# EAGLE design onion_dip_v21 (EAGLE 6.5.0)
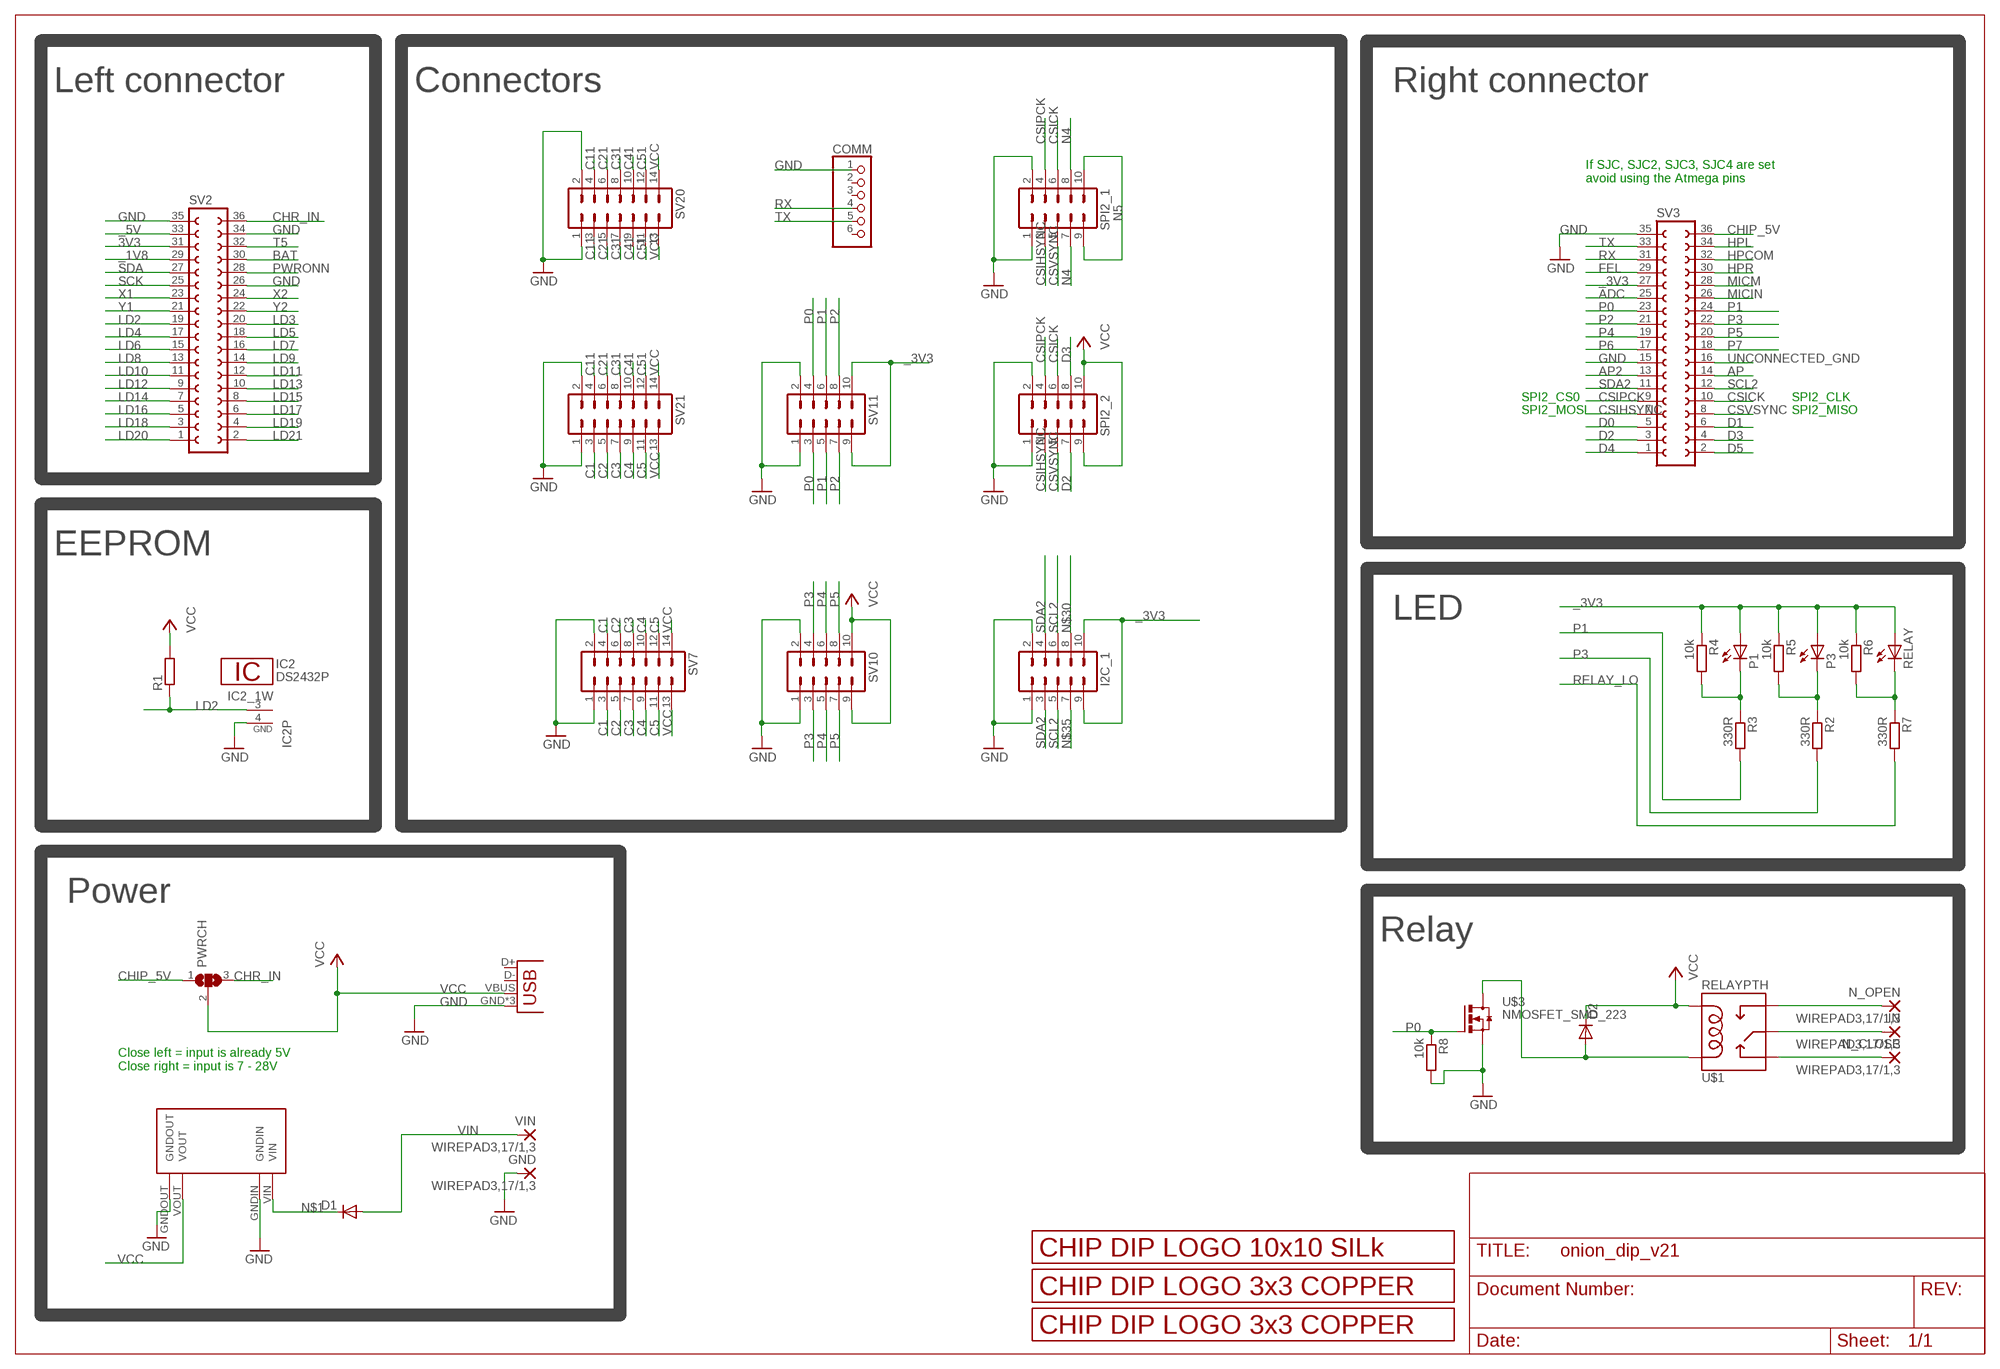
[diagram p0: schematic, sheet 1]

## Parts
COMM  PINHD-1X6  [1X06]
D1  DIODE-SMB  [SMB]
D2  DIODE-SMB  [SMB]
GND  WIREPAD3,17/1,3  [3,17/1,3]
I2C_1  MA05-2  [MA05-2]
IC2  DS2432P  [TSOC6]
IN  WIREPAD3,17/1,3  [3,17/1,3]
N_CLOSE  WIREPAD3,17/1,3  [3,17/1,3]
N_OPEN  WIREPAD3,17/1,3  [3,17/1,3]
P1  LEDCHIP-LED0805  [CHIP-LED0805]
P3  LEDCHIP-LED0805  [CHIP-LED0805]
PWRCH  SJ2W  [SJ_2]
R1  R-EU_R0805  [R0805]
R2  330R  R-EU_R0805  [R0805]
R3  330R  R-EU_R0805  [R0805]
R4  10k  R-EU_R0805  [R0805]
R5  10k  R-EU_R0805  [R0805]
R6  10k  R-EU_R0805  [R0805]
R7  330R  R-EU_R0805  [R0805]
R8  10k  R-EU_R0805  [R0805]
RELAY  LEDCHIP-LED0805  [CHIP-LED0805]
SPI2_1  MA05-2  [MA05-2]
SPI2_2  MA05-2  [MA05-2]
SV2  FE18-2  [FE18-2]
SV3  FE18-2  [FE18-2]
SV7  MA07-2  [MA07-2]
SV10  MA05-2  [MA05-2]
SV11  MA05-2  [MA05-2]
SV20  MA07-2  [MA07-2]
SV21  MA07-2  [MA07-2]
U$1  RELAYPTH  [SRD-05VDC-SL-C]
U$3  NMOSFET_SMD_223  [SOT223]
U$4  LOGO_3X3_COPPER  [LOGO_3X3_COPPER]
U$5  LOGO_10X10_SILK  [LOGO_10X10_SILK]
U$6  LOGO_3X3_COPPER  [LOGO_3X3_COPPER]
U$9  MP1584EN_FRAMELESS  [MP1584EN_FRAMELESS]
USB  USBUSB-MICROB-SMT-DIP  [USB-MICROB-SMT-DIP]
VIN  WIREPAD3,17/1,3  [3,17/1,3]

## Nets
3V3: SV2.31
_1V8: SV2.29
_3V3: I2C_1.9 I2C_1.10 P1.A P3.A R4.1 R5.1 R6.1 RELAY.A SV3.27 SV11.9 SV11.10
_5V: SV2.33
ADC: SV3.25
AP: SV3.14
AP2: SV3.13
BAT: SV2.30
C1: SV7.3 SV7.4 SV21.3
C2: SV7.5 SV7.6 SV21.5
C3: SV7.7 SV7.8 SV21.7
C4: SV7.9 SV7.10 SV21.9
C5: SV7.11 SV7.12 SV21.11
C11: SV20.3 SV20.4 SV21.4
C21: SV20.5 SV20.6 SV21.6
C31: SV20.7 SV20.8 SV21.8
C41: SV20.9 SV20.10 SV21.10
C51: SV20.11 SV20.12 SV21.12
CHIP_5V: PWRCH.1 SV3.36
CHR_IN: PWRCH.3 SV2.36
CSICK: SPI2_1.6 SPI2_2.6 SV3.10
CSIHSYNC: SPI2_1.3 SPI2_2.3 SV3.7
CSIPCK: SPI2_1.4 SPI2_2.4 SV3.9
CSVSYNC: SPI2_1.5 SPI2_2.5 SV3.8
D0: SV3.5
D1: SV3.6
D2: SPI2_2.7 SV3.3
D3: SPI2_2.8 SV3.4
D4: SV3.1
D5: SV3.2
FEL: SV3.29
GND: COMM.1 GND.1(P) I2C_1.1 I2C_1.2 IC2.4(GND) R8.2 SPI2_1.1 SPI2_1.2 SPI2_2.1 SPI2_2.2 SV2.26 SV2.34 SV2.35 SV3.15 SV3.35 SV7.1 SV7.2 SV10.1 SV10.2 SV11.1 SV11.2 SV20.1 SV20.2 SV21.1 SV21.2 U$3.3(S) U$9.GNDIN U$9.GNDOUT USB.GND USB.MT1(GND) USB.MT2(GND)
HPCOM: SV3.32
HPL: SV3.34
HPR: SV3.30
LD2: IC2.3(1W) R1.1 SV2.19
LD3: SV2.20
LD4: SV2.17
LD5: SV2.18
LD6: SV2.15
LD7: SV2.16
LD8: SV2.13
LD9: SV2.14
LD10: SV2.11
LD11: SV2.12
LD12: SV2.9
LD13: SV2.10
LD14: SV2.7
LD15: SV2.8
LD16: SV2.5
LD17: SV2.6
LD18: SV2.3
LD19: SV2.4
LD20: SV2.1
LD21: SV2.2
MICIN: SV3.26
MICM: SV3.28
N4: SPI2_1.7 SPI2_1.8
N5: SPI2_1.9 SPI2_1.10
N$1: D1.C U$9.VIN
N$3: P3.C R2.1 R5.2
N$4: P1.C R3.1 R4.2
N$29: R6.2 R7.1 RELAY.C
N$30: I2C_1.8
N$35: I2C_1.7
NCL: N_CLOSE.1(P) U$1.SWCLOSED(SWCLOSE)
NOP: N_OPEN.1(P) U$1.SWOPEN
P0: R8.1 SV3.23 SV11.3 SV11.4 U$3.1(G)
P1: R3.2 SV3.24 SV11.5 SV11.6
P2: SV3.21 SV11.7 SV11.8
P3: R2.2 SV3.22 SV10.3 SV10.4
P4: SV3.19 SV10.5 SV10.6
P5: SV3.20 SV10.7 SV10.8
P6: SV3.17
P7: SV3.18
PWRONN: SV2.28
RELAY_LO: D2.A R7.2 U$1.COIL1 U$3.2(D) U$3.4(D)
RIN: IN.1(P) U$1.SWCOMMON
RX: COMM.4 SV3.31
SCK: SV2.25
SCL2: I2C_1.5 I2C_1.6 SV3.12
SDA: SV2.27
SDA2: I2C_1.3 I2C_1.4 SV3.11
T5: SV2.32
TX: COMM.5 SV3.33
UNCONNECTED_GND: SV3.16
VCC: D2.C PWRCH.2 R1.2 SPI2_2.9 SPI2_2.10 SV7.13 SV7.14 SV10.9 SV10.10 SV20.13 SV20.14 SV21.13 SV21.14 U$1.COIL0 U$9.VOUT USB.VBUS
VIN: D1.A VIN.1(P)
X1: SV2.23
X2: SV2.24
Y1: SV2.21
Y2: SV2.22
Unconnected: COMM.2 COMM.3 COMM.6 USB.D+ USB.D-

## Notes on the sheet
- Left connector | Connectors | Right connector
- If SJC, SJC2, SJC3, SJC4 are set 
  avoid using the Atmega pins
- SPI2_CS0 | SPI2_CLK
- SPI2_MOSI | SPI2_MISO
- EEPROM
- LED
- Power
- Relay
- Close left = input is already 5V
  Close right = input is 7 - 28V

## Library data of the parts
COMM = pinhead:PINHD-1X6: PIN HEADER
D1 D2 = diode:DIODE-: DIODE
GND IN N_CLOSE N_OPEN VIN = wirepad:WIREPAD: Wire PAD connect wire on PCB
I2C_1 SPI2_1 SPI2_2 SV10 SV11 = con-lstb_no_frame:MA05-2: PIN HEADER; OC_FARNELL: unknown; OC_NEWARK: unknown
IC2 = 1wire:DS2432: 1024-Bit Protected EEPROM with SHA-1 Engine This chip is a cryptographic device, providing 1024 Bits of EEPROM memory which may be written only after supplying the correct 64 bit secret. the secret cannot be read back from the device. The other features of this chip are like the DS2431. Please note the SHA-1 hash algorithm is considered weak if the data is not properly "padded". If you don't understand anything of this, don't use this chip. Author: Jan Kandziora <jjj@gmx.de>
P1 P3 RELAY = led:LED: LED OSRAM: - CHIPLED LG R971, LG N971, LY N971, LG Q971, LY Q971, LO R971, LY R971 LH N974, LH R974 LS Q976, LO Q976, LY Q976 LO Q996 - Hyper CHIPLED LW Q18S LB Q993, LB Q99A, LB R99A - SideLED LS A670, LO A670, LY A670, LG A670, LP A670 LB A673, LV A673, LT A673, LW A673 LH A674 LY A675 LS A676, LA A676, LO A676, LY A676, LW A676 LS A679, LY A679, LG A679 - Hyper Micro SIDELED® LS Y876, LA Y876, LO Y876, LY Y876 LT Y87S - SmartLED LW L88C, LW L88S LB L89C, LB L89S, LG L890 LS L89K, LO L89K, LY L89K LS L896, LA L896, LO L896, LY L896 - TOPLED LS T670, LO T670, LY T670, LG T670, LP T670 LSG T670, LSP T670, LSY T670, LOP T670, LYG T670 LG T671, LOG T671, LSG T671 LB T673, LV T673, LT T673, LW T673 LH T674 LS T676, LA T676, LO T676, LY T676, LB T676, LH T676, LSB T676, LW T676 LB T67C, LV T67C, LT T67C, LS T67K, LO T67K, LY T67K, LW E67C LS E67B, LA E67B, LO E67B, LY E67B, LB E67C, LV E67C, LT E67C LW T67C LS T679, LY T679, LG T679 LS T770, LO T770, LY T770, LG T770, LP T770 LB T773, LV T773, LT T773, LW T773 LH T774 LS E675, LA E675, LY E675, LS T675 LS T776, LA T776, LO T776, LY T776, LB T776 LHGB T686 LT T68C, LB T68C - Hyper Mini TOPLED® LB M676 - Mini TOPLED Santana® LG M470 LS M47K, LO M47K, LY M47K Source: http://www.osram.convergy.de LUXEON: - LUMILED® LXK2-PW12-R00, LXK2-PW12-S00, LXK2-PW14-U00, LXK2-PW14-V00 LXK2-PM12-R00, LXK2-PM12-S00, LXK2-PM14-U00 LXK2-PE12-Q00, LXK2-PE12-R00, LXK2-PE12-S00, LXK2-PE14-T00, LXK2-PE14-U00 LXK2-PB12-K00, LXK2-PB12-L00, LXK2-PB12-M00, LXK2-PB14-N00, LXK2-PB14-P00, LXK2-PB14-Q00 LXK2-PR12-L00, LXK2-PR12-M00, LXK2-PR14-Q00, LXK2-PR14-R00 LXK2-PD12-Q00, LXK2-PD12-R00, LXK2-PD12-S00 LXK2-PH12-R00, LXK2-PH12-S00 LXK2-PL12-P00, LXK2-PL12-Q00, LXK2-PL12-R00 Source: www.luxeon.com KINGBRIGHT: KA-3528ASYC Source: www.kingbright.com
PWRCH = jumper:SJ2W: SMD solder JUMPER
R1-R8 = rcl:R-EU_: RESISTOR, European symbol
SV2 SV3 = con-lsta:FE18-2: FEMALE HEADER; OC_FARNELL: unknown; OC_NEWARK: unknown
SV7 SV20 SV21 = con-lstb_no_frame:MA07-2: PIN HEADER; OC_FARNELL: unknown; OC_NEWARK: unknown
U$1 = SRD-05VDC-SL-C:RELAY: SPDT relay (COM-00101)
U$3 = transistor-power:NMOSFET_SMD_223
U$4 U$6 = logo:LOGO_3X3_COPPER
U$5 = logo:LOGO_10X10_SILK
U$9 = power_supply:MP1584EN_FRAMELESS
USB = Spark:USB

## Board
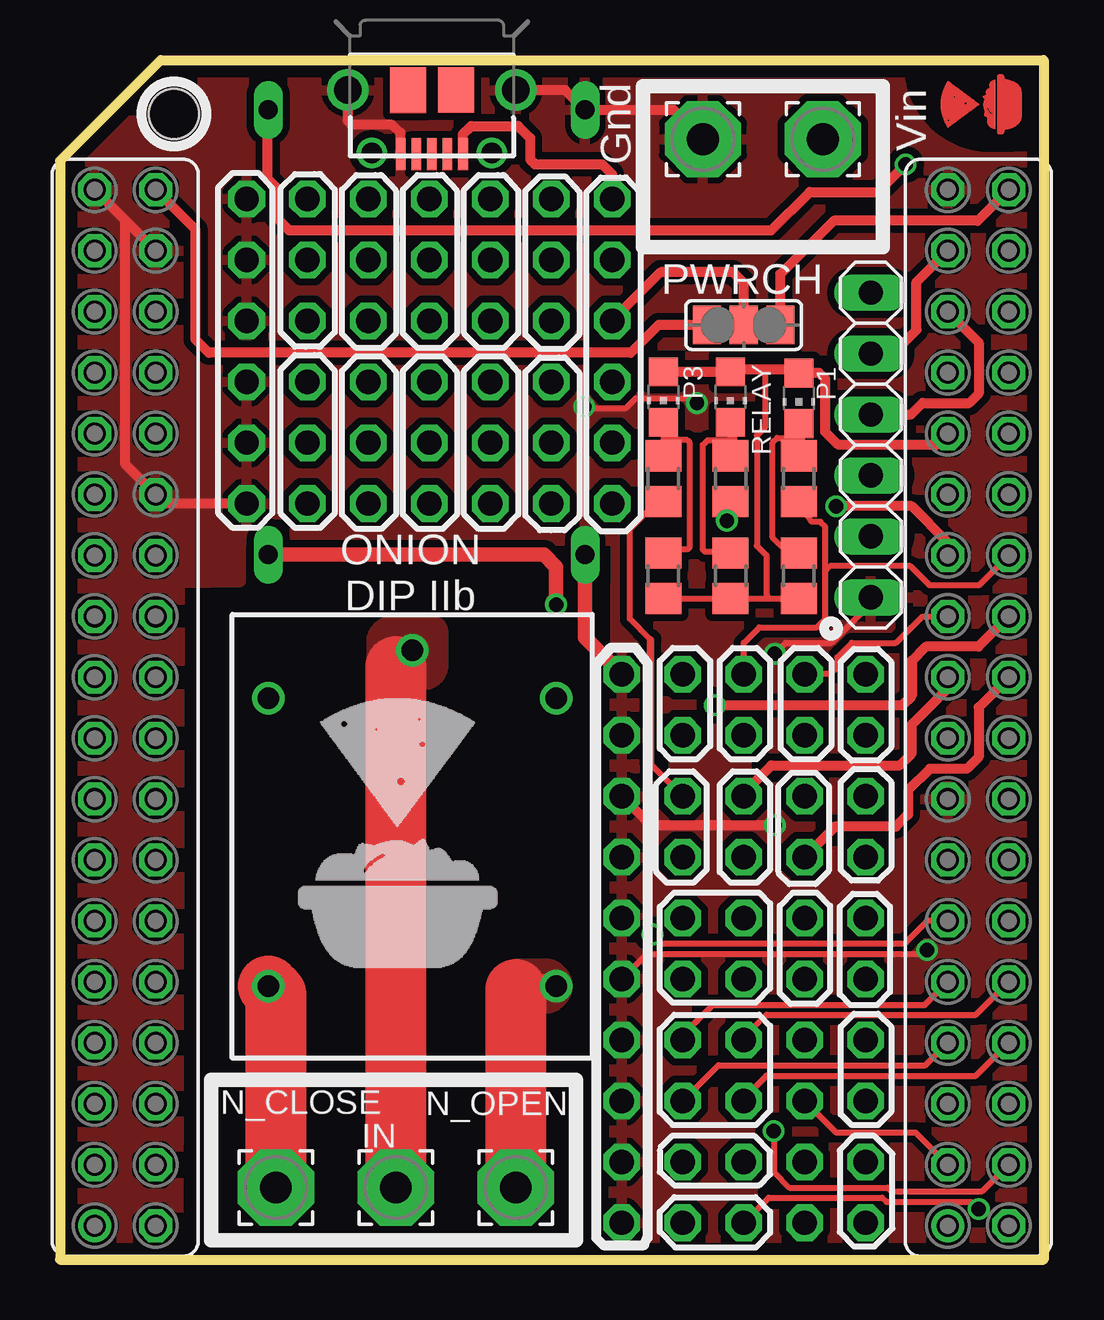
[diagram p1: board, top side]
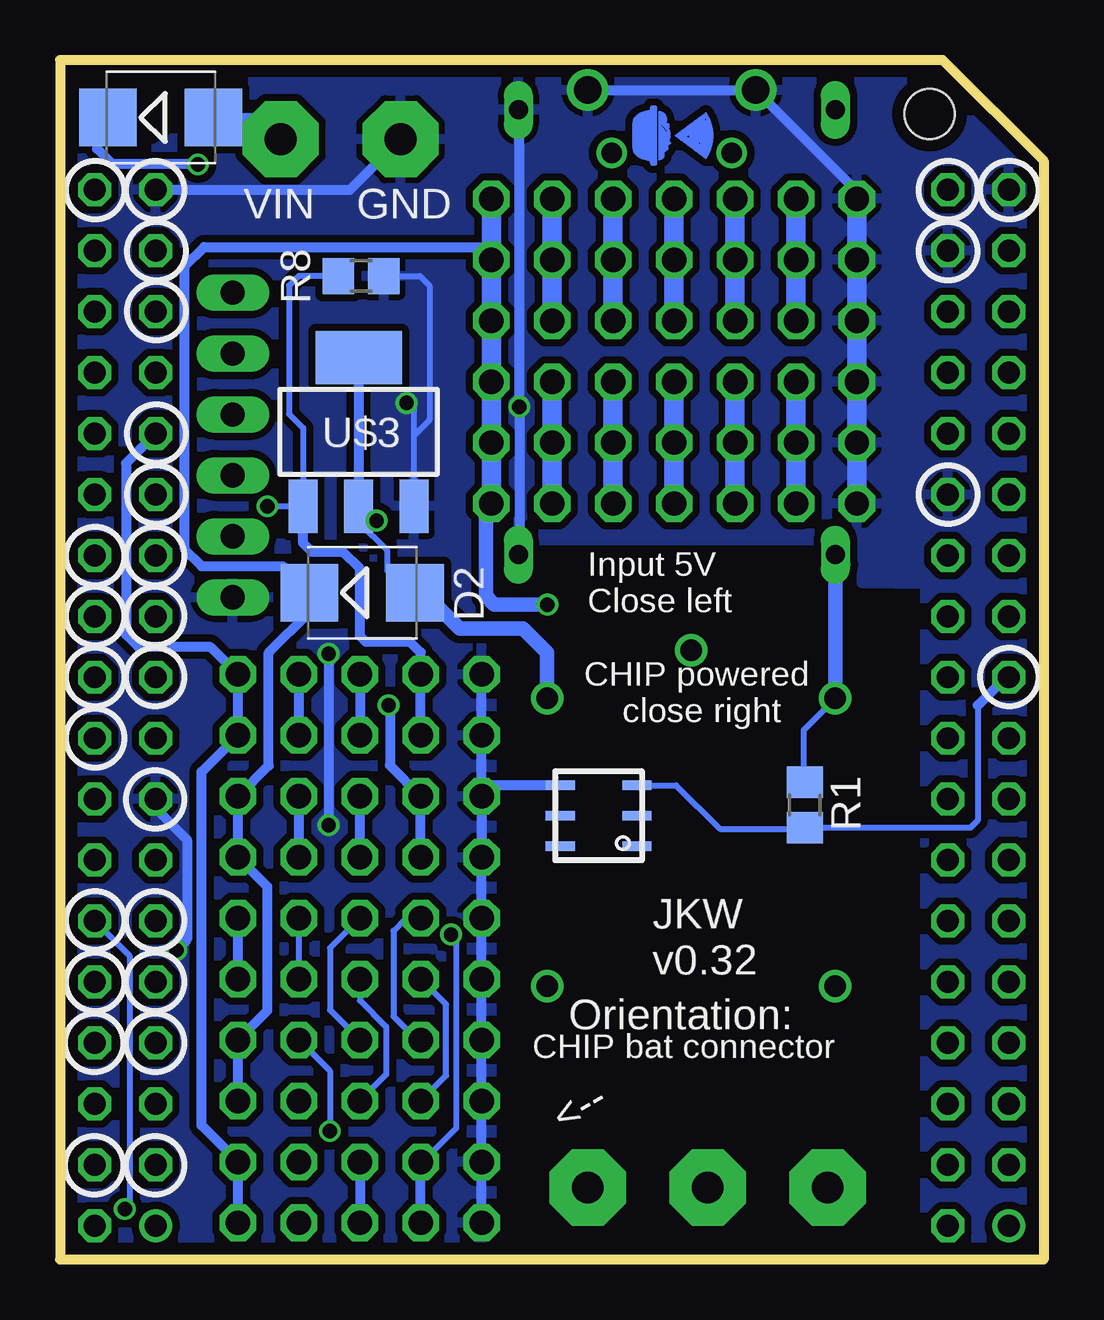
[diagram p2: board, bottom side, seen from below]

Size 41 x 50 mm. Coordinates in mm from the lower left corner, seen from the top.
Outline: 4.2,50 41,50 41,0 0,0 0,45.8 4.2,50
Copper layers (1*16): Top 0.035mm / dielectric 1.6mm / Bottom 0.035mm
Design rules "Elecrow_2-layer_PCB_eagle_rule": minimum track width 6mil, minimum drill 12mil, track to track 6mil, track to pad 6mil, pad to pad 6mil, via to via 8mil, smd to smd 0mil, copper to edge 20mil, drill to drill 10mil, minimum pad ring 6mil, minimum via ring 6mil, stop-mask expansion 0mil, vias tented up to drill 100mil, thermal gap 10mil
Holes 2.1 mm at 4.75,47.75

### Footprints (pad centres in the part's own frame; a part is rotated, then mirrored left to right if it is on the bottom)
1X06 = drill 1.016 long: 1 -6.35,0; 2 -3.81,0; 3 -1.27,0; 4 1.27,0; 5 3.81,0; 6 6.35,0
SMB = smd 2.4 x 2.4: A 2.2,0; C -2.2,0
3,17/1,3 = drill 1.321 pad 3.175 octagon: 1 0,0
MA05-2 = drill 1.016 octagon: 1 -5.08,-1.27; 2 -5.08,1.27; 3 -2.54,-1.27; 4 -2.54,1.27; 5 0,-1.27; 6 0,1.27; 7 2.54,-1.27; 8 2.54,1.27; 9 5.08,-1.27; 10 5.08,1.27
TSOC6 = smd 0.406 x 1.219: 1 -1.27,-1.6; 2 0,-1.6; 3 1.27,-1.6; 4 1.27,1.6; 5 0,1.6; 6 -1.27,1.6
CHIP-LED0805 = smd 1.2 x 1.2: A 0,-1.05; C 0,1.05
SJ_2 = smd 1.168 x 1.6: 1 -1.524,0; 2 0,0; 3 1.524,0
R0805 = smd 1.3 x 1.5: 1 -0.95,0; 2 0.95,0
FE18-2 = drill 0.914: 1 -21.59,1.27 | drill 0.914 octagon: 2 -21.59,-1.27; 3 -19.05,1.27; 4 -19.05,-1.27; 5 -16.51,1.27; 6 -16.51,-1.27; 7 -13.97,1.27; 8 -13.97,-1.27; 9 -11.43,1.27; 10 -11.43,-1.27; 11 -8.89,1.27; 12 -8.89,-1.27; 13 -6.35,1.27; 14 -6.35,-1.27; 15 -3.81,1.27; 16 -3.81,-1.27; 17 -1.27,1.27; 18 -1.27,-1.27; 19 1.27,1.27; 20 1.27,-1.27; 21 3.81,1.27; 22 3.81,-1.27; 23 6.35,1.27; 24 6.35,-1.27; 25 8.89,1.27; 26 8.89,-1.27; 27 11.43,1.27; 28 11.43,-1.27; 29 13.97,1.27; 30 13.97,-1.27; 31 16.51,1.27; 32 16.51,-1.27; 33 19.05,1.27; 34 19.05,-1.27; 35 21.59,1.27; 36 21.59,-1.27
MA07-2 = drill 1.016 octagon: 1 -7.62,-1.27; 2 -7.62,1.27; 3 -5.08,-1.27; 4 -5.08,1.27; 5 -2.54,-1.27; 6 -2.54,1.27; 7 0,-1.27; 8 0,1.27; 9 2.54,-1.27; 10 2.54,1.27; 11 5.08,-1.27; 12 5.08,1.27; 13 7.62,-1.27; 14 7.62,1.27
SRD-05VDC-SL-C = drill 0.9: COIL0 -5.39,-6.12; COIL1 -5.39,5.88; SWCLOSED 6.61,-6.12; SWCOMMON -7.39,-0.12; SWOPEN 6.61,5.88
SOT223 = smd 1.219 x 2.235: 1 -2.311,-3.099; 2 0,-3.099; 3 2.311,-3.099 | smd 3.6 x 2.2: 4 0,3.099
MP1584EN_FRAMELESS = drill 0.8 long: GNDIN 1.778,14.986; GNDOUT 20.32,14.986; VIN 1.778,1.778; VOUT 20.32,1.778
USB-MICROB-SMT-DIP = smd 0.4 x 1.35: D+ 0,2.675; D- -0.65,2.675; GND 1.3,2.675; ID 0.65,2.675; VBUS -1.3,2.675 | drill 1.15 pad 1.7: MT1 -3.5,0; MT2 3.5,0 | drill 0.85 pad 1.25: MT3 -2.5,2.625; MT4 2.5,2.625 | smd 1.5 x 1.9: P$1 -1,0; P$2 1,0.01

### Placement (x,y rotation side)
COMM  33.8,33.95 90 top
D1  36.8,47.6 0 bottom
D2  28.4,27.8 0 bottom
GND  26.8,46.7 180 top
I2C_1  28.5,2.8 0 top
IC2  18.55,18.5 90 bottom
IN  14,3 0 top
N_CLOSE  9,3 0 top
N_OPEN  19,3 0 top
P1  30.8,35.9 180 top
P3  25.15,35.95 180 top
PWRCH  28.5,38.95 180 top
R1  9.95,18.95 90 bottom
R2  25.15,32.55 270 top
R3  30.8,32.55 270 top
R4  30.8,28.5 90 top
R5  25.15,28.5 90 top
R6  27.95,28.5 90 top
R7  27.95,32.55 270 top
R8  28.45,41 0 bottom
RELAY  27.95,35.95 180 top
SPI2_1  28.5,12.96 0 top
SPI2_2  28.5,7.88 0 top
SV2  2.72,23 90 top
SV3  38.28,23 90 top
SV7  15.4,32.78 0 top
SV10  28.5,18.04 0 top
SV11  28.5,23.12 0 top
SV20  15.4,42.94 0 top
SV21  15.4,37.86 0 top
U$1  14.8,18 270 top
U$3  28.55,34.5 0 bottom
U$4  38.4,48.15 90 top
U$5  9.9,12.15 0 top
U$6  15.45,46.85 270 bottom
U$9  6.9,49.7 270 top
USB  15.5,48.75 180 top
VIN  31.8,46.7 180 top

### Tracks (layer width: path | path; a pad name or v marks a point on that pad's centre or on a via)
_3V3
  Top 0.254: 29.35,37.1 29.4,37.05 29.4,34.7 29.05,34.35 29.05,29.75 29.45,29.35 29.45,27.7 29.5,27.65 29.5,27.6 29.45,27.55 | R5.1 R6.1 29.45,27.55 | 29.45,27.55 R4.1
  Top 0.406: SV3.27 36.53,33.95 32.45,33.95 31.9,34.5 31.9,36.7 31.65,36.95 P1.A | 28.1,37 RELAY.A | P1.A 30.45,37.1 29.35,37.1 28.05,37.1 RELAY.A | 30.55,36.95 P1.A | RELAY.A P3.A
  Bottom 0.406: I2C_1.9 I2C_1.10 35.1,5.59 35.1,20.33 SV11.9 SV11.10 34.74,25.55 37.75,25.55 38.25,26.05 38.25,33.19 SV3.27
C1
  Bottom 0.813: SV21.3 SV7.4 SV7.3
C2
  Bottom 0.813: SV21.5 SV7.6 SV7.5
C3
  Bottom 0.813: SV7.7 SV7.8 SV21.7
C4
  Bottom 0.813: SV7.9 SV7.10 SV21.9
C5
  Bottom 0.813: SV7.11 SV7.12 SV21.11
C11
  Bottom 0.813: SV21.4 SV20.3 SV20.4
C21
  Bottom 0.813: SV21.6 SV20.5 SV20.6
C31
  Bottom 0.813: SV21.8 SV20.7 SV20.8
C41
  Bottom 0.813: SV21.10 SV20.9 SV20.10
C51
  Bottom 0.813: SV21.12 SV20.11 SV20.12
CHIP_5V
  Top 0.406: SV3.36 38.26,43.3 32.25,43.3 30.02,41.07 PWRCH.1
CHR_IN
  Top 0.406: SV2.36 5.65,42.93 5.65,38.35 6.2,37.8 23.8,37.8 24.95,38.95 PWRCH.3
CSICK
  Top 0.254: SPI2_2.6 28.5,9.25 29.45,10.2 38.18,10.2 SV3.10
  Bottom 0.254: SPI2_1.6 29.75,12.98 29.75,10.4 SPI2_2.6
CSIHSYNC
  Top 0.254: SPI2_2.3 27.45,8.1 36.08,8.1 SV3.7
  Bottom 0.254: SPI2_1.3 24.9,10.63 24.9,7.67 SPI2_2.3
CSIPCK
  Top 0.254: SPI2_2.4 25.96,9.36 27.21,10.61 36.05,10.61 SV3.9
  Bottom 0.254: 26.42,14.23 SPI2_1.4 26.57,14.23 27.1,13.7 27.1,10.14 26.11,9.15 SPI2_2.4
CSVSYNC
  Top 0.254: SV3.8 38.18,7.66 29.44,7.66 28.5,6.72 SPI2_2.5
  Bottom 0.254: SPI2_1.5 28.5,10.8 27.4,9.7 27.4,7.71 SPI2_2.5
D2
  Top 0.254: SPI2_2.7 32.35,5.3 35.66,5.3 SV3.3
D3  (via drill 0.6)
  Top 0.254: v29.75,5.35 29.75,3.65 30.4,3 34.5,3 34.65,2.85 38.45,2.85 SV3.4
  Bottom 0.254: SPI2_2.8 29.75,7.86 v29.75,5.35
GND  (via drill 0.6)
  Top 0.254: v36.15,12.9 35.99,12.74 24.47,12.74 SPI2_1.1 | v21.85,35.55 21.9,35.5 23.6,35.5 24,35.9 26.35,35.9 v26.55,35.7 | COMM.1 33.8,27.35 32.15,25.7 30.25,25.7 v29.8,25.25
  Top 0.406: GND.1 25.58,47.92 U$9.GNDIN 21.06,48.75 USB.MT1 | SV2.35 2.72,43.32 | 2.72,43.32 SV2.34 | v29.8,18.1 24.63,18.1 SV10.2 | USB.GND 14.2,46.95 13.85,47.3 12.15,47.3 12,47.45 USB.MT2 | SV7.1 4.37,31.51 SV2.26 2.7,33.18 2.7,43.3 2.72,43.32
  Top 0.61: SV11.2 21.89,25.92 U$9.GNDOUT
  Bottom 0.254: U$3.3 26.24,34.35 | 26.24,34.35 26.24,35.39 v26.55,35.7 | R8.2 26,41 25.6,40.6 25.6,34.99 26.24,34.35
  Bottom 0.406: I2C_1.1 I2C_1.2 SPI2_2.1 SPI2_2.2 SPI2_1.1 SPI2_1.2 SV10.1 | SV10.2 SV11.1 SV11.2 | SV3.15 37.01,18.81 35.7,17.5 35.7,13.35 v36.15,12.9 | U$3.3 26.24,31.29 | v29.8,25.25 v29.8,18.1 | SV10.2 SV10.1 | 23.02,17.17 SV10.1 | USB.MT1 USB.MT2 7.78,44.53 SV20.2 | IC2.4 22.96,19.77 SV10.2 | U$9.GNDIN 21.85,47.89 v21.85,35.55 21.85,29.42 | SV3.35 28.91,44.59 GND.1
  Bottom 0.61: 21.85,29.42 U$9.GNDOUT
  Bottom 0.813: SV7.1 SV7.2 SV21.1 SV21.2 SV20.1 SV20.2
  pour Top (isolate 0.305, rank 2): 23.08,0.35 40.88,0.25 41.01,10.57 41,46 38.55,45.95 arc-90 35,50 4.2,50 0,45.8 0,10.47 -0.1,0.05 4.95,0.05 5,28.2 7.55,28.25 7.55,30 23.15,29.95 23.15,28.05 23.13,28.1
  pour Bottom (isolate 0.305): 2.6,48.45 4.2,50 35,50 35,49.45 arc90 38.45,46 41,46 41.05,0.25 23,0.2 23,28.1 23.1,28.05 23.1,30 7.6,30 7.6,28.2 4.95,28.15 4.95,0.25 0.02,0.25 -0.03,45.8
LD2
  Bottom 0.254: 2.75,23.1 2.75,18.3 3.05,18 R1.1 10,17.95 13.5,17.95 15.32,19.77 IC2.3
  Bottom 0.406: SV2.19 1.58,24.27 2.75,23.1
LD5
  Top 0.406: 4.11,21.85 SV2.18
N4
  Bottom 0.254: SPI2_1.7 SPI2_1.8
N5
  Bottom 0.406: SPI2_1.9 SPI2_1.10
N$1  (via drill 0.6)
  Top 0.406: v35.25,45.65 34.1,44.5 31.25,44.5 29.65,42.9 9.55,42.9 9.05,43.4 9.05,44.65 8.66,45.04 8.66,47.9 U$9.VIN
  Bottom 0.406: v35.25,45.65 38.8,45.65 39.45,46.3 D1.C
N$3
  Top 0.254: 25.5,33.55 R2.1 25.15,34.15 | R5.2 25.7,29.6 26.15,29.6 26.25,29.7 26.25,34.05 26.15,34.15 25.15,34.15 | P3.C 25.15,34.15
N$4
  Top 0.254: R4.2 30.25,29.55 29.7,30.1 29.7,34.05 29.9,34.25 30.85,34.25
  Top 0.406: P1.C 30.85,34.25 R3.1
N$29
  Top 0.254: R6.2 27.45,29.5 26.9,29.5 26.8,29.6 26.8,33.95 27,34.15 27.95,34.15 28.04,34.06
  Top 0.406: RELAY.C 28.04,34.06 R7.1 28,33.45 28,33.5 28.1,33.6
NCL
  Top 2.54: N_CLOSE.1 9,11.07 U$1.SWCLOSED
NOP
  Top 1.016: U$1.SWOPEN 20.04,11.39 18.68,10.03 | 18.68,10.03 18.35,9.7 | 19,11.26 18.99,9.71 18.68,10.03
  Top 2.54: N_OPEN.1 19,11.26
  pour Top (no thermals): 19.05,12.35 20.2,12.35 arc-90 21.15,11.4 arc-90 20.2,10.45 19.1,10.45 arc-90 19,10.55 19,12.3
P0  (via drill 0.6)
  Top 0.406: SV3.23 37.01,29.89 35.5,31.4 v32.35,31.4
  Bottom 0.254: v32.35,31.4 31.85,31.4 U$3.1 30.86,34.66 31.45,35.25 31.45,40.6 31.05,41 R8.1
  Bottom 0.406: SV11.3 SV11.4 25.96,25.31 26.4,25.75 28.25,25.75 28.5,26 28.5,28.8 29.2,29.5 30.5,29.5 30.86,29.86 U$3.1 30.9,31.36
P1
  Top 0.254: SV11.6 28.5,25.7 29.15,26.35 31.55,26.35 31.9,26.7 31.9,28.7 | SV3.24 38.3,28.1 36.25,28.1 35.45,28.9 32.1,28.9 31.9,28.7 | 31.9,28.7 31.9,30.55 31.7,30.75 31.35,30.75 R3.2
  Bottom 0.406: SV11.6 SV11.5
P2
  Top 0.254: SV11.8 32.1,24.4 32.4,24.7 32.4,25.1 33,25.7 34.85,25.7 35.95,26.8 SV3.21
  Bottom 0.406: SV11.7 SV11.8
P3  (via drill 0.6)
  Top 0.254: 24.62,20.65 SV10.4 | 24.62,25.83 23.75,26.7 23.75,30.45 24.7,31.4 R2.2 24.9,31.6
  Top 0.305: 24.62,20.65 24.62,25.83
  Top 0.406: SV3.22 38.29,25.55 36.1,25.55 35.5,24.95 35.5,23.5 35.1,23.1 v27.3,23.1
  Bottom 0.406: v27.3,23.1 27.25,23.05 27.25,20.6 SV10.4 SV10.3
P4
  Top 0.406: SV10.6 28.5,19.45 29.65,20.6 35,20.6 35.5,21.1 35.5,22.3 37.01,23.81 SV3.19
  Bottom 0.406: SV10.5 SV10.6
P5
  Top 0.406: SV3.20 38.3,23.02 38.3,20.95 37.8,20.45 36.25,20.45 35.35,19.55 35.35,18.55 34.85,18.05 32.32,18.05 SV10.7
  Bottom 0.406: SV10.7 SV10.8
RELAY_LO  (via drill 0.6)
  Top 0.254: R7.2 27.95,30.95 v27.8,30.8
  Bottom 0.254: D2.A 26.45,27.8 27.35,28.7 27.35,29.55 28.55,30.75 28.55,30.8 | 28.55,30.8 U$3.2 | v27.8,30.8 28.55,30.8
  Bottom 0.406: U$3.4 U$3.2
  Bottom 0.61: D2.A 25.85,27.8 24.35,26.3 21.7,26.3 20.7,25.3 20.7,23.41 U$1.COIL1
RIN
  Top 1.016: U$1.SWCOMMON 14,24.71
  Top 2.54: IN.1 14,24.71
  pour Top (no thermals): 12.95,24.6 arc-90 12.9,24.65 12.9,25.75 arc-90 13.85,26.7 15.55,26.7 arc-90 16.05,26.2 16.05,24.75 arc-90 15.15,23.85 14.9,23.85 arc90 14.25,24.5 12.95,24.5
RX
  Top 0.406: COMM.4 35.47,35.22 35.95,35.7 37.9,35.7 38.3,36.1 38.3,38.22 SV3.31
SCL2  (via drill 0.6)
  Top 0.254: I2C_1.5 29.55,2.58 34.27,2.58 34.45,2.4 38,2.4 v38.3,2.1
  Bottom 0.254: SV3.12 38.1,12.66 38.1,2.3 v38.3,2.1
  Bottom 0.406: I2C_1.6 I2C_1.5
SDA2  (via drill 0.6)
  Top 0.254: SV3.11 36.16,14.11 35.2,13.15 25.1,13.15 v24.7,13.55
  Bottom 0.254: I2C_1.4 25.88,4.07 24.47,5.48 24.47,13.32 v24.7,13.55
  Bottom 0.406: I2C_1.3 I2C_1.4
TX
  Top 0.406: COMM.5 34.71,37.76 35.7,38.75 35.7,40.74 SV3.33
VCC  (via drill 0.6)
  Top 0.406: v20.68,27.3 20.48,27.5 | USB.VBUS 16.8,46.9 17.15,47.25 19.1,47.25 19.6,46.75 19.6,45.85 19.8,45.65 22.6,45.65 23.02,45.23 SV20.14 | PWRCH.2 28.5,40.7 28.05,41.15 25.04,41.15 SV21.14
  Top 0.61: 20.58,27.4 v20.68,27.3 20.68,28.87 20.17,29.38 U$9.VOUT | 28.7,39.15 PWRCH.2
  Bottom 0.254: 10,19.95 10,22.07 U$1.COIL0
  Bottom 0.406: SPI2_2.9 SPI2_2.10 32.35,10.38 32.35,15.54 SV10.9 SV10.10 32.3,20.59 32.3,25.3 30.6,27 D2.C 31.7,28.9 35.1,28.9 35.8,29.6 35.8,41.4 35,42.2 23.07,42.2 23.02,42.25 | 8.25,28.95 U$9.VOUT | 10,19.95 R1.2
  Bottom 0.61: 23.02,33.67 SV7.14 | SV7.13 23.25,31.28 23.25,27.65 22.9,27.3 v20.68,27.3 | U$1.COIL0 U$9.VOUT
  Bottom 0.813: SV7.13 SV7.14 SV21.13 SV21.14 SV20.13 23.02,42.25 SV20.14
VIN
  Bottom 0.406: D1.A 32.7,47.6 VIN.1

### Text on the board
tPlace: Gnd | Vin | ONION / DIP IIb
bPlace: JKW / v0.32 | Orientation: | CHIP bat connector | <--
tNames: not ordered
bNames: Input 5V / Close left | CHIP powered / close right